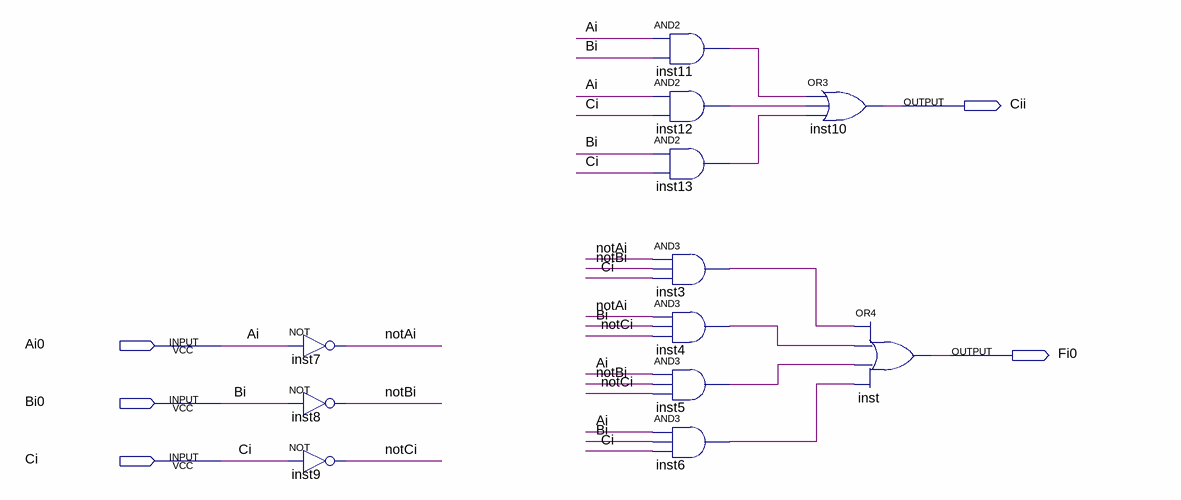
[diagram p0: schematic sheet]
// Quartus schematic ADD1.bdf as structural Verilog: 12 symbols, 5 pins
module ADD1 (
  input  Ai0,
  input  Bi0,
  input  Ci,
  output Cii,
  output Fi0
);

  wire inst3_out, inst4_out, inst5_out, inst6_out, inst11_out, inst12_out, inst13_out, notAi, notBi, notCi;

  not inst7 (notAi, Ai0);
  not inst8 (notBi, Bi0);
  not inst9 (notCi, Ci);
  and inst11 (inst11_out, Ai0, Bi0);
  and inst12 (inst12_out, Ai0, Ci);
  and inst13 (inst13_out, Bi0, Ci);
  and inst3 (inst3_out, notAi, notBi, Ci);
  and inst4 (inst4_out, notAi, Bi0, notCi);
  and inst5 (inst5_out, Ai0, notBi, notCi);
  and inst6 (inst6_out, Ai0, Bi0, Ci);
  or inst10 (Cii, inst11_out, inst12_out, inst13_out);
  or inst (Fi0, inst3_out, inst4_out, inst5_out, inst6_out);

  // Other names for the same wires on the sheet: Ai = Ai0; Bi = Bi0
endmodule
